# Altium schematic sheet Power Circuits.SchDoc
size A4
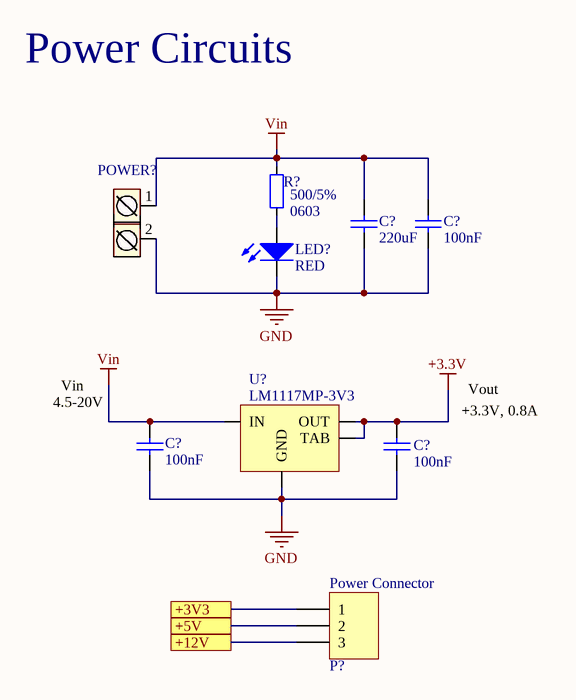
[diagram p0: Power Circuits.SchDoc]

## Parts
(Parts that share a designator on the sheet are numbered #1, #2 ... from top to bottom, then left to right.)
C?#1  value 220uF  [0603_CAP]  (hidden comment: Cap)
C?#2  value 100nF  [0603_CAP]  (hidden comment: Cap)
C?#3  value 100nF  [0603_CAP]  (hidden comment: Cap)
C?#4  value 100nF  [0603_CAP]  (hidden comment: Cap)
LED?  RED  [0603_led_red]
P?  HDR1X3  [Molex SPOX Horizontal 3 Circuits]  (value not drawn)
POWER?  ARK2  [ARK2]  (value not drawn)
R?  500/5%  [0603]
U?  LM1117MP-3V3  [SOT223]

## Ports
+3V3, +5V, +12V

## Nets
+3.3V: C?#4.1 U?.2(OUT) U?.4(TAB)
GND: C?#1.1 C?#2.1 C?#3.2 C?#4.2 LED?.2(K) POWER?.2 U?.1(GND)
Vin: C?#1.2 C?#2.2 C?#3.1 POWER?.1 R?.2 U?.3(IN)
+3V3: P?.1 ; port +3V3
+5V: P?.2 ; port +5V
+12V: P?.3 ; port +12V
NetLED?_1: LED?.1(A) R?.1

## Notes on the sheet
- Power Circuits
- (near C?#3) 4.5-20V
- Vin
- +3.3V, 0.8A
- Vout
- (near P?) Power Connector

## Library data of the parts
C?#1-C?#4 = Cap: Ceramic capacitor; Unit Price1: *; Unit Price2: *
LED? = LED: Light-emitting diode; COLOR: RED
P? = HDR1X3: Header, 3-Pin; LatestRevisionDate: 17-Jul-2002; LatestRevisionNote: Re-released for DXP Platform.; Publisher: Altium Limited
POWER? = ARK2: Złącze śrubowe 2 piny
R? = RES: Resistior; Value: 500/5%; Package: 0603
U? = LM1117MP-3V3: 800mA Low-Dropout Linear Regulator; PartNumber: LM1117MP-3.3; Manufacturer: National Semiconductor; CompType: LDO IC; PackageTopMarking: XYTT*N05A; PowerWise: N; DatasheetVersion: Apr-2006; PackageVersion: revB, Apr-2003; PackageReference: MP04A; PackageDescription: Molded SOT-223, 6.50 x 3.56 x 1.6mm Body, 4 Lead, 2.3mm Pitch; ComponentLink1Description: LM1117 Datasheet; ComponentLink1URL: http://www.national.com/ds/LM/LM1117.pdf; ComponentLink2Description: LM1117 Web Page; ComponentLink2URL: http://www.national.com/pf/LM/LM1117.html; Published: 4-Dec-2008; Publisher: Altium Limited; RoHS: O; PinCount: 4; DigiKeyPartNumber: LM1117MP-3.3CT-ND; Code_JEDEC: TO-261-AA; Code_IPC: SOT223-4; ComponentLink3Description: MP04A Package Page; ComponentLink3URL: http://www.national.com/packaging/folders/mp04a.html